# EasyEDA Pro project OptoGrid_V0.05.eprj, schematic OptoGrid_Battery_V0.05
Board Name: OptoGrid_Battery_V0.05; Create Date: 2025-07-05; Page Name: Power and sensors; Project Name: OptoGrid_V0.05; Schematic Name: OptoGrid_Battery_V0.05; Update Date: 2025-09-04; Company: 嘉立创EDA; Drawed: Fukui (Daniel) Yang; Page Size: A4; Version: V1.0
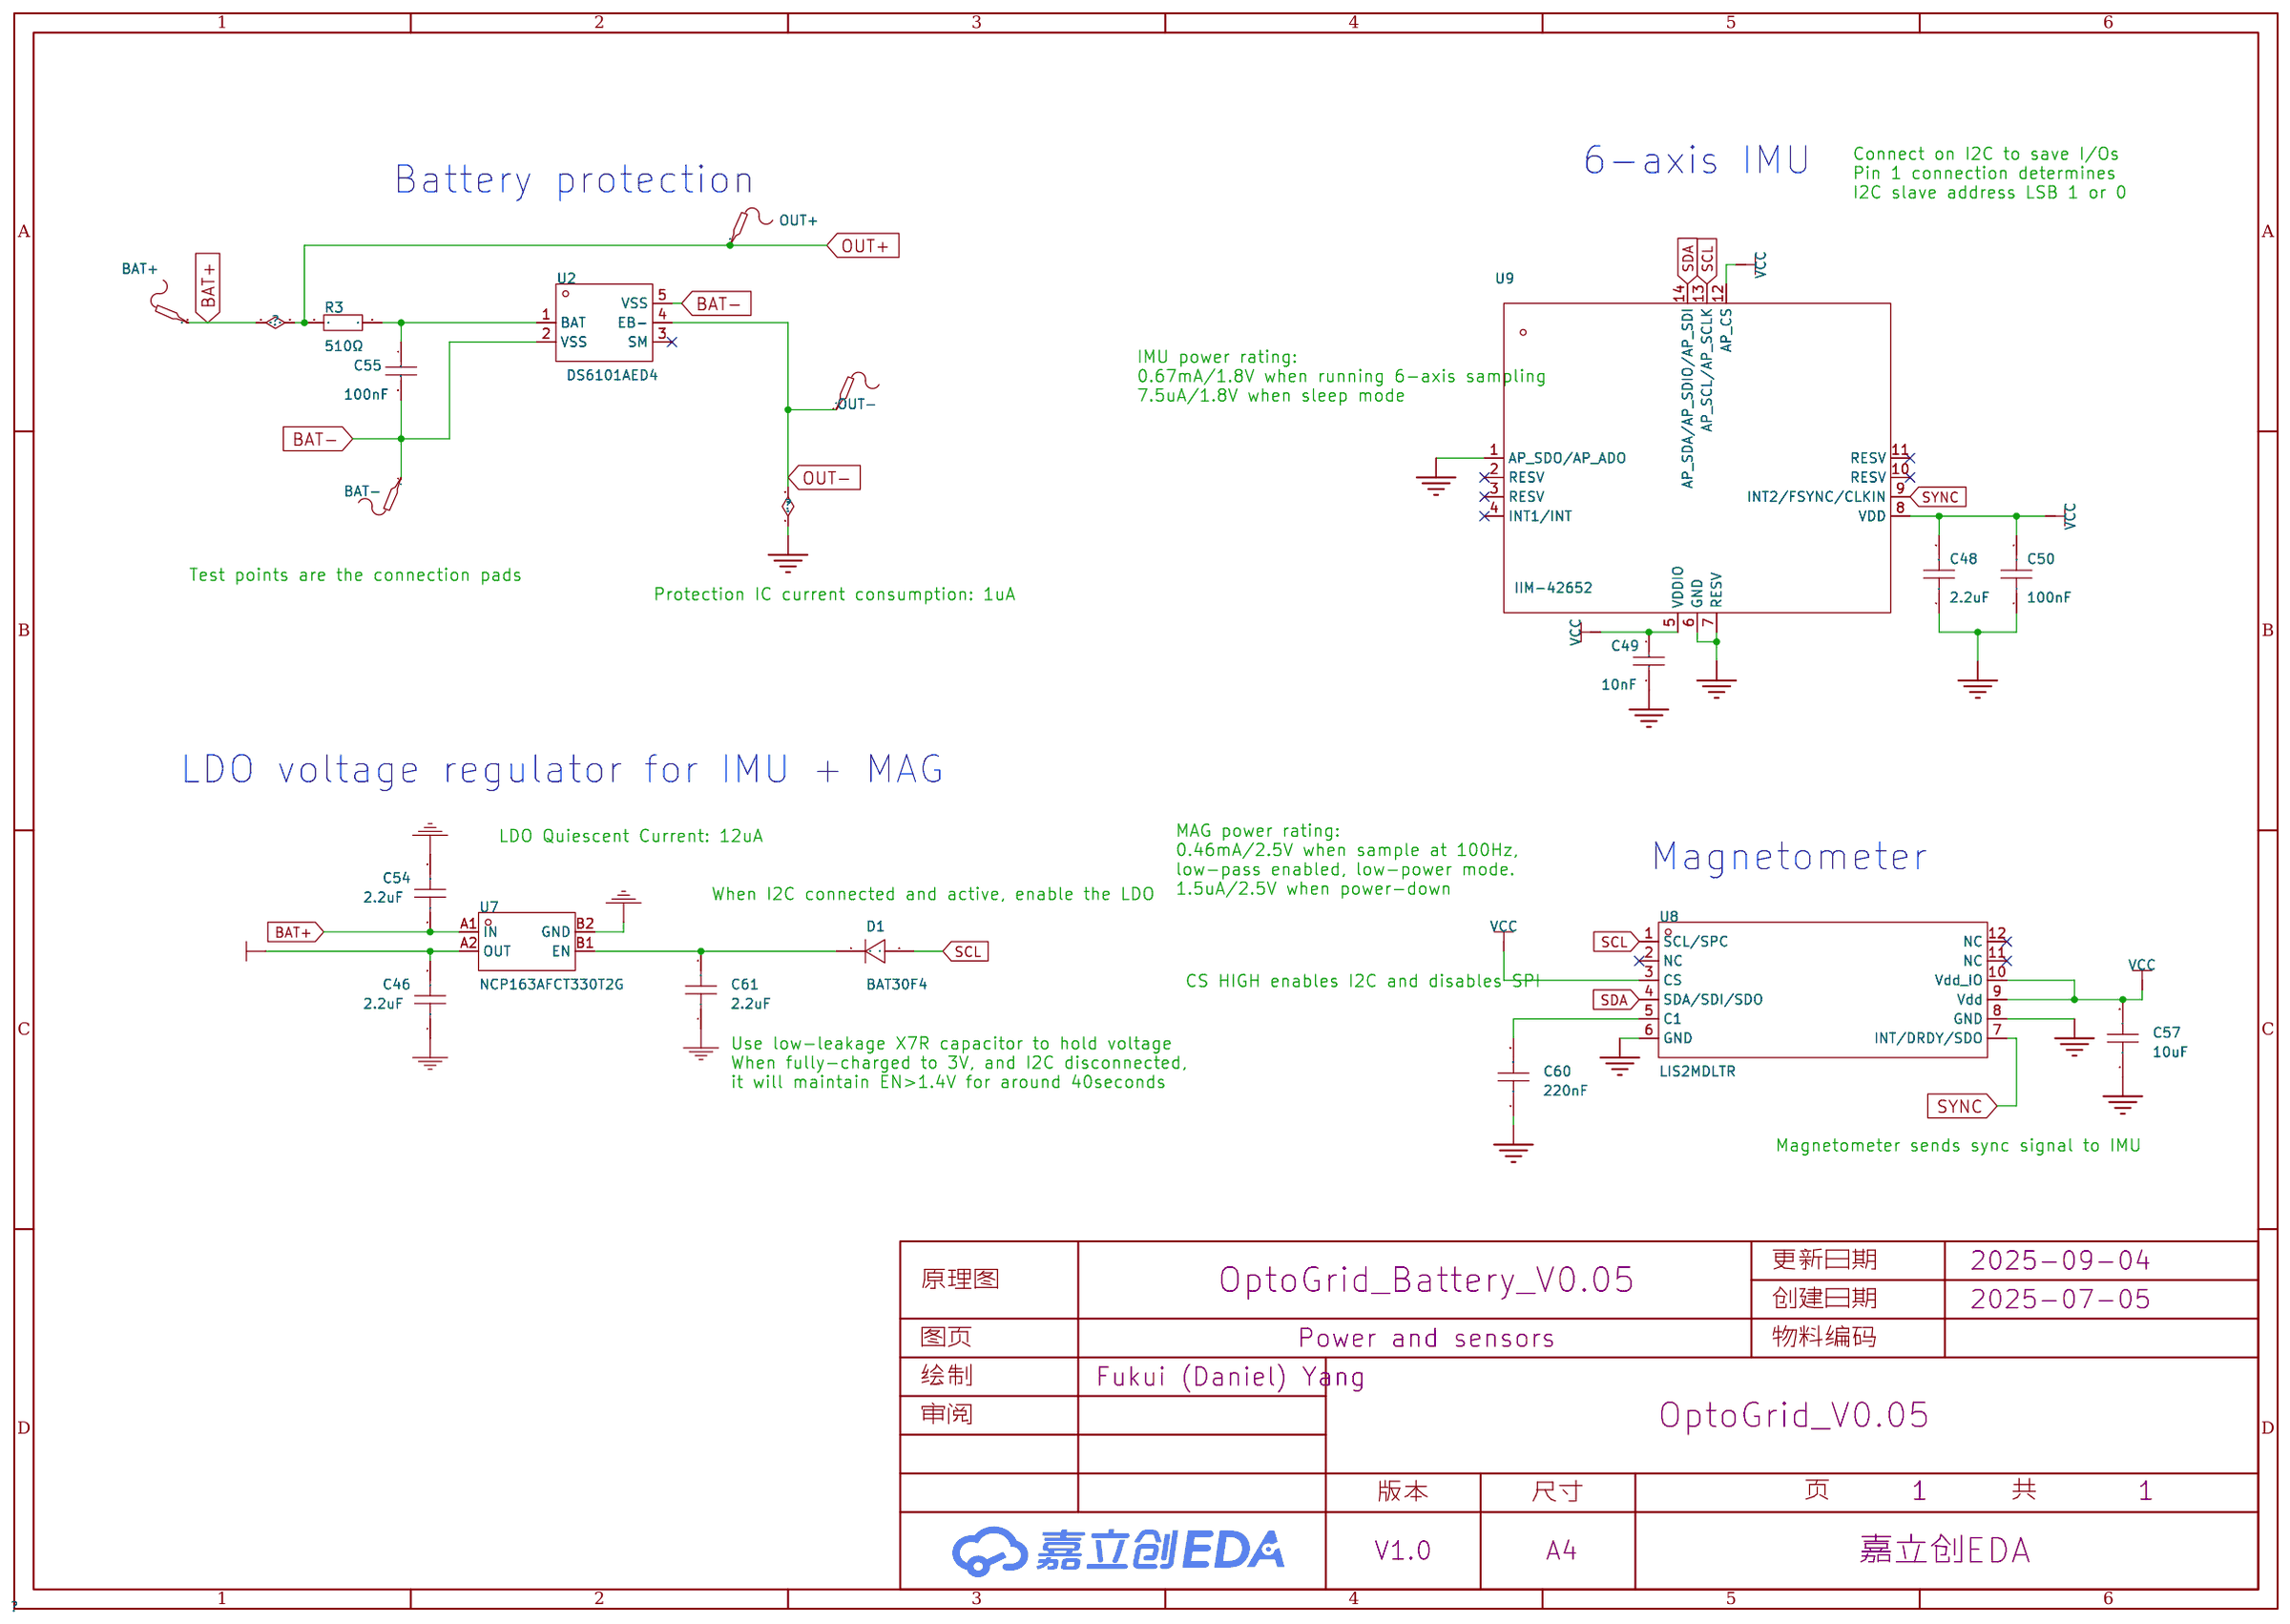
[diagram p4: schematic sheet]

## Parts
BAT+  -  [Test-Point-0.5mm]
BAT-  -  [Test-Point-0.5mm]
C46  2.2uF  [C0201]
C48  2.2uF  [C0201]
C49  10nF  [C0201]
C50  100nF  [C0201]
C54  2.2uF  [C0201]
C55  100nF  [C0201]
C57  10uF  [C0402]
C60  220nF  [C0201]
C61  2.2uF  [C0402]
D1  BAT30F4  [DFN0603-D_L0.6-W0.3-P0.34-RD]
OUT+  -  [Test-Point-0.5mm]
OUT-  -  [Test-Point-0.5mm]
R3  510Ω  [R0201]
U2  DS6101AED4  [DFN-4_L1.0-W1.0-P0.65-BL-EP]
U7  NCP163AFCT330T2G  [WLCSP-4_L0.6-W0.6-P0.35-R2-C2-TL]
U8  LIS2MDLTR  [LGA-12_L2.0-W2.0-P0.50-BL]
U9  IIM-42652  [LGA-14_L3.0-W2.5-P0.50-TL]

## Library data of the parts
BAT+ BAT- OUT+ OUT- = Test-Point: Test Point 测试点
C46 C48 C54 = GRM033R61A225KE47D: 容值:2.2uF;精度:±10%;额定电压:10V;材质(温度系数):X5R;; LCSC Part Name: 2.2uF ±10% 10V; Supplier Part: C335106; Manufacturer: muRata(村田); Supplier Footprint: 0201; JLCPCB Part Class: 扩展库; Datasheet: https://atta.szlcsc.com/upload/public/pdf/source/20200305/C490387_23319AE8C154DEB24C505E6C82A8106A.pdf; Supplier: LCSC; Tolerance: ±10%; Voltage Rated: 10V; Temperature Coefficient: X5R
C49 = GRM033R71A103KA01D: 容值:10nF;精度:±10%;额定电压:10V;材质(温度系数):X7R;; LCSC Part Name: 10nF ±10% 10V; Supplier Part: C76941; Manufacturer: muRata(村田); Supplier Footprint: 0201; JLCPCB Part Class: Extended Part; Datasheet: https://atta.szlcsc.com/upload/public/pdf/source/20180307/C76941_15204091038901407729.pdf; Supplier: LCSC; Tolerance: ±10%; Voltage Rated: 10V; Temperature Coefficient: X7R
C50 = GRM033Z71A104KE14D: 容值:100nF;精度:±10%;额定电压:10V;材质(温度系数):X7R;; LCSC Part Name: 100nF ±10% 10V; Supplier Part: C161494; Manufacturer: muRata(村田); Supplier Footprint: 0201; JLCPCB Part Class: 扩展库; Datasheet: https://atta.szlcsc.com/upload/public/pdf/source/20181119/C161494_7C14CD1E604AF2690E90D16E0278156D.pdf; Supplier: LCSC; Tolerance: ±10%; Voltage Rated: 10V; Temperature Coefficient: X7R
C55 = GRM033R61E104KE14D: 容值:100nF;精度:±10%;额定电压:25V;材质(温度系数):X5R;; LCSC Part Name: 100nF ±10% 25V; Supplier Part: C76939; Manufacturer: muRata(村田); Supplier Footprint: 0201; JLCPCB Part Class: Extended Part; Datasheet: https://atta.szlcsc.com/upload/public/pdf/source/20180307/C76939_15204091018551407727.pdf; Supplier: LCSC; Tolerance: ±10%; Voltage Rated: 25V; Temperature Coefficient: X5R
C57 = CL05A106MP5NUNC: 容值:10uF;精度:±20%;额定电压:10V;材质(温度系数):X5R;; LCSC Part Name: 10uF ±20% 10V; Supplier Part: C315248; Manufacturer: SAMSUNG(三星); Supplier Footprint: 0402; JLCPCB Part Class: 扩展库; Datasheet: https://atta.szlcsc.com/upload/public/pdf/source/20231220/1EF805BAE1520675928CC4638D279E74.pdf; Supplier: LCSC; Tolerance: ±20%; Voltage Rated: 10V; Temperature Coefficient: X5R
C60 = GRM033R61E224KE01D: 容值:220nF;精度:±10%;额定电压:25V;材质(温度系数):X5R;; LCSC Part Name: 220nF ±10% 25V; Supplier Part: C701263; Manufacturer: muRata(村田); Supplier Footprint: 0201; JLCPCB Part Class: Extended Part; Datasheet: https://atta.szlcsc.com/upload/public/pdf/source/20200407/C503309_0211D99E6F86B2657E389DD3F8367252.pdf; Supplier: LCSC; Tolerance: ±10%; Voltage Rated: 25V; Temperature Coefficient: X5R
C61 = GRM155Z71A225KE01D: 容值:2.2uF;精度:±10%;额定电压:10V;材质(温度系数):X7R;; LCSC Part Name: 2.2uF ±10% 10V; Supplier Part: C2997286; Manufacturer: muRata(村田); Supplier Footprint: 0402; JLCPCB Part Class: 扩展库; Datasheet: https://atta.szlcsc.com/upload/public/pdf/source/20220829/B8FE0067CE648DEA50203A5BE382F6B9.pdf; Supplier: LCSC; Tolerance: ±10%; Voltage Rated: 10V; Temperature Coefficient: X7R
D1 = BAT30F4: 正向压降(Vf):625mV@300mA;直流反向耐压(Vr):30V;平均整流电流(Io):300mA;; LCSC Part Name: 电压:30V 电流:300mA; Supplier Part: C314018; Manufacturer: ST(意法半导体); Supplier Footprint: 0201; JLCPCB Part Class: 扩展库; Datasheet: https://atta.szlcsc.com/upload/public/pdf/source/20181210/C314018_50BFE9E29FED27C39CE5C54F1586C636.pdf; Supplier: LCSC; Forward Voltage (Vf@If): 625mV@300mA; Reverse Voltage (Vr): 30V; Average Rectified Current (Io): 300mA; Reverse Leakage Current (Ir): 50uA@30V
R3 = RC0201FR-07510RL: 电阻类型:厚膜电阻;阻值:510Ω;精度:±1%;功率:50mW;最大工作电压:25V;温度系数:±200ppm/℃;; LCSC Part Name: 厚膜电阻 510Ω ±1% 50mW; Supplier Part: C57784; Manufacturer: YAGEO(国巨); Supplier Footprint: 0201; JLCPCB Part Class: Extended Part; Datasheet: https://atta.szlcsc.com/upload/public/pdf/source/20181009/C309620_DA5935B6E1D48212CB7A533FE518B3C2.pdf; Supplier: LCSC; Type: 厚膜电阻; Tolerance: ±1%; Power(Watts): 50mW; Overload Voltage (Max): 25V; Temperature Coefficient: ±200ppm/℃; Operating Temperature Range: -55℃~+125℃
U2 = DS6101AED4: 超低静态电流，带船运模式，适用于TWS耳机; LCSC Part Name: 锂电池保护芯片; Supplier Part: C7499469; Manufacturer: DSTECH(奥简科技); Supplier Footprint: DFN-4L(1x1); JLCPCB Part Class: Extended Part; Datasheet: https://atta.szlcsc.com/upload/public/pdf/source/20231201/DEF2DD3321564EEF592C272488CBF649.pdf; Supplier: LCSC
U7 = NCP163AFCT330T2G: 输出类型:-;; LCSC Part Name: LDO 稳压器，250 mA，超高 PSRR，超低噪音; Supplier Part: C603648; Manufacturer: onsemi(安森美); Supplier Footprint: WLCSP-4; JLCPCB Part Class: 扩展库; Datasheet: https://atta.szlcsc.com/upload/public/pdf/source/20200927/C603657_74821F5CD7CAE943477E5F5DC4975E14.pdf; Supplier: LCSC
U8 = LIS2MDLTR: 磁传感器、数字输出、50高斯磁场动态范围、超低功耗、高性能、3轴磁力计; LCSC Part Name: 霍尔效应开关; Supplier Part: C919695; Manufacturer: ST(意法半导体); Supplier Footprint: LGA-12(2x2); JLCPCB Part Class: 扩展库; Datasheet: https://atta.szlcsc.com/upload/public/pdf/source/20211119/145E3A73C2A09E2C981D93C27CF540FA.pdf; Supplier: LCSC
U9 = IIM-42652: 轴向:X,Y,Z;; LCSC Part Name: 传感器; Supplier Part: C2988404; Manufacturer: TDK InvenSense(应美盛); Supplier Footprint: LGA-14(2.5x3); JLCPCB Part Class: 扩展库; Supplier: LCSC; Axial Direction: X,Y,Z; Supply Voltage: 1.71V~3.6V; Operating Temperature: -40℃~+105℃

## Nets
GND: C46.1 C48.1 C49.1 C50.1 C54.2 C57.1 C60.1 C61.1 OUT-.1 U2.4(EB-) U7.B2(GND) U8.6(GND) U8.8(GND) U9.1(AP_SDO/AP_ADO) U9.6(GND) U9.7(RESV)
VCC: C46.2 C48.2 C49.2 C50.2 C57.2 U7.A2(OUT) U8.3(CS) U8.9(Vdd) U8.10(Vdd_IO) U9.5(VDDIO) U9.8(VDD) U9.12(AP_CS)
BAT+: BAT+.1 C54.1 OUT+.1 R3.1 U7.A1(IN)
BAT-: BAT-.1 C55.2 U2.2(VSS) U2.5(VSS)
SCL: D1.2 U8.1(SCL/SPC) U9.13(AP_SCL/AP_SCLK)
SDA: U8.4(SDA/SDI/SDO) U9.14(AP_SDA/AP_SDIO/AP_SDI)
SYNC: U8.7(INT/DRDY/SDO) U9.9(INT2/FSYNC/CLKIN)
$1N1923: C60.2 U8.5(C1)
$1N2753: C55.1 R3.2 U2.1(BAT)
$1N3706: C61.2 D1.1 U7.B1(EN)

Not connected (* = marked no-connect by the designer): U2 3(SM)*; U8 2(NC)* 11(NC)* 12(NC)*; U9 2(RESV)* 3(RESV)* 4(INT1/INT)* 10(RESV)* 11(RESV)*

## Notes on the sheet
- Connect on I2C to save I/Os
  Pin 1 connection determines
  I2C slave address LSB 1 or 0
- 6-axis IMU
- Battery protection
- IMU power rating:
  0.67mA/1.8V when running 6-axis sampling
  7.5uA/1.8V when sleep mode
- Test points are the connection pads
- Protection IC current consumption: 1uA
- LDO voltage regulator for IMU + MAG
- LDO Quiescent Current: 12uA
- MAG power rating:
  0.46mA/2.5V when sample at 100Hz,
  low-pass enabled, low-power mode.
  1.5uA/2.5V when power-down
- Magnetometer
- When I2C connected and active, enable the LDO
- CS HIGH enables I2C and disables SPI
- Use low-leakage X7R capacitor to hold voltage
  When fully-charged to 3V, and I2C disconnected,
  it will maintain EN>1.4V for around 40seconds
- Magnetometer sends sync signal to IMU
